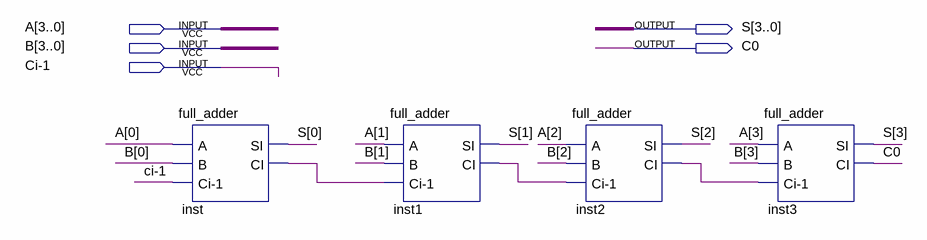
[diagram p0: schematic sheet]
// Quartus schematic 4_ADDER.bdf as structural Verilog: 4 symbols, 5 pins
module \4_ADDER  (
  input  [3:0] A,
  input  [3:0] B,
  input  \Ci-1 ,
  output [3:0] S,
  output C0
);

  wire inst1_ci, inst2_ci, inst_ci;

  full_adder inst (.A(A[0]), .B(B[0]), .\Ci-1 (\Ci-1 ), .SI(S[0]), .CI(inst_ci));
  full_adder inst1 (.A(A[1]), .B(B[1]), .\Ci-1 (inst_ci), .SI(S[1]), .CI(inst1_ci));
  full_adder inst2 (.A(A[2]), .B(B[2]), .\Ci-1 (inst1_ci), .SI(S[2]), .CI(inst2_ci));
  full_adder inst3 (.A(A[3]), .B(B[3]), .\Ci-1 (inst2_ci), .SI(S[3]), .CI(C0));
endmodule
